# EAGLE design SCMount (EAGLE 5.10)
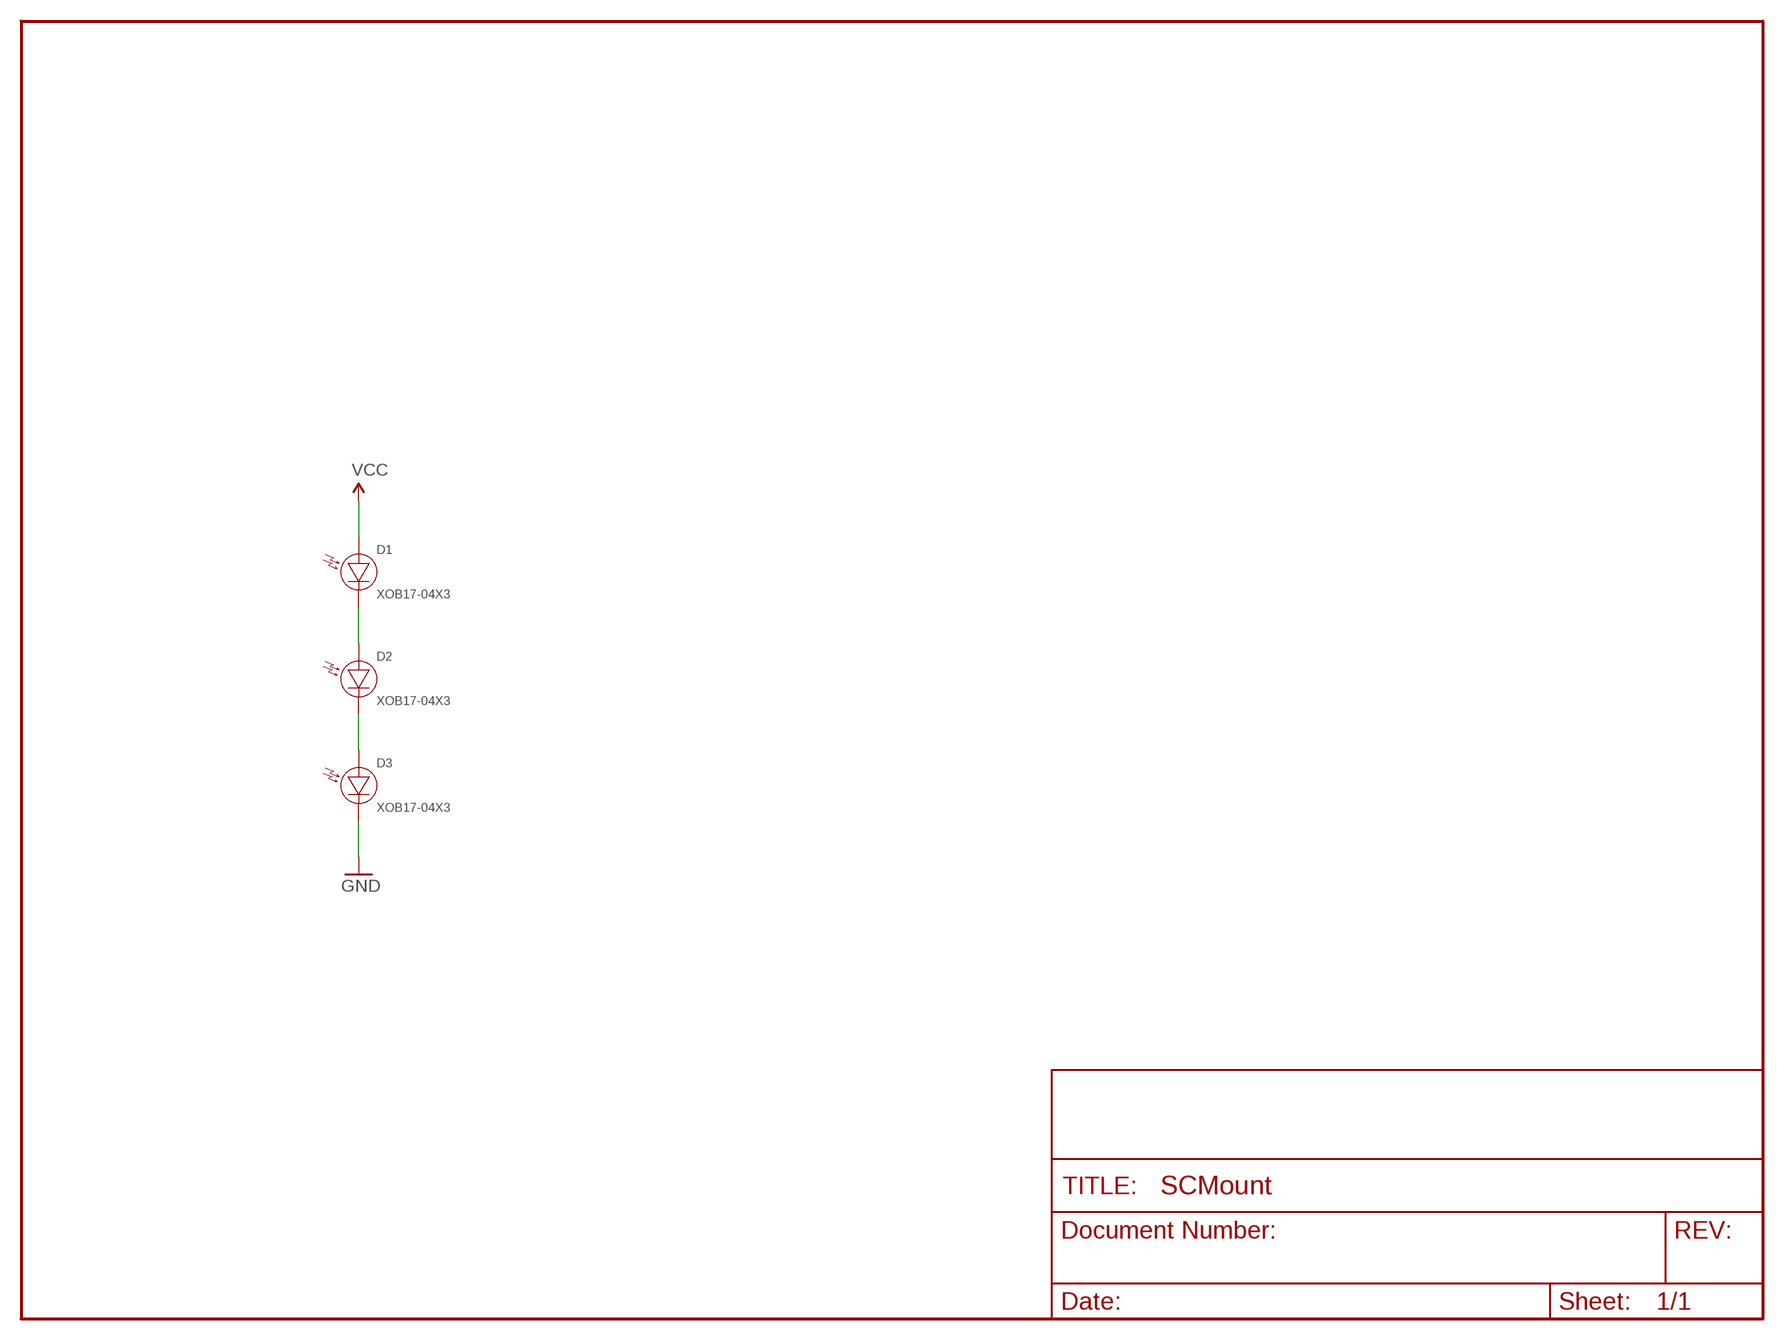
[diagram p0: schematic, sheet 1]

## Parts
D1  XOB17-04X3  [XOB17-04X3]
D2  XOB17-04X3  [XOB17-04X3]
D3  XOB17-04X3  [XOB17-04X3]

## Nets
GND: D3.-(C)
N$1: D2.-(C) D3.+(A)
N$2: D1.-(C) D2.+(A)
VCC: D1.+(A)

## Library data of the parts
D1-D3 = umich:XOB17-04X3

## Board
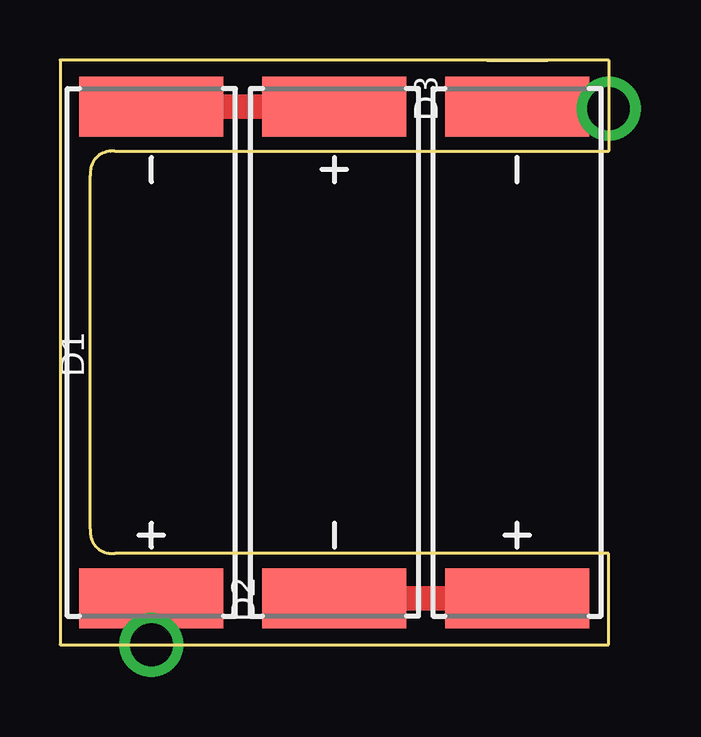
[diagram p1: board, top side]

Size 22.86 x 24.38 mm. Coordinates in mm from the lower left corner, seen from the top.
Outline: 0,0 22.86,0 22.86,3.81 2.29,3.81 arc-106 1.27,4.83 1.27,19.56 arc-106 2.29,20.57 22.86,20.57 22.86,24.38 0,24.38 0,0
Copper layers (1*16): Top 0.035mm / dielectric 1.5mm / Bottom 0.035mm
Design rules "default": minimum track width 10mil, minimum drill 24mil, track to track 8mil, track to pad 8mil, pad to pad 8mil, via to via 8mil, smd to smd 8mil, copper to edge 40mil, drill to drill 8mil, minimum pad ring 10mil, minimum via ring 8mil, stop-mask expansion 4mil, vias tented up to drill 0mil, thermal gap 10mil

### Footprints (pad centres in the part's own frame; a part is rotated, then mirrored left to right if it is on the bottom)
XOB17-04X3 = smd 2.5 x 6: + -10.25,0; - 10.25,0

### Placement (x,y rotation side)
D1  3.81,12.19 90 top
D2  11.43,12.19 270 top
D3  19.05,12.19 90 top

### Tracks (layer width: path | path; a pad name or v marks a point on that pad's centre or on a via)
GND  (via drill 1.78)
  Top 1.016: D3.- 22.86,22.44 v22.86,22.35
N$1
  Top 1.016: D2.- D3.+
N$2
  Top 1.016: D1.- 10.92,22.44 10.92,22.61 11.43,22.61 D2.+
VCC  (via drill 1.78)
  Top 1.016: D1.+ v3.81,0